# Altium schematic sheet COM-Radio-UHF.SchDoc: CDH Connector
size A2; CompanyName: Lockheed Martin; Organization: Colorado Space Grant; DocumentNumber: 4; SheetNumber: 6; SheetTotal: 7; ProjectName: COM_Digital.prjpcb
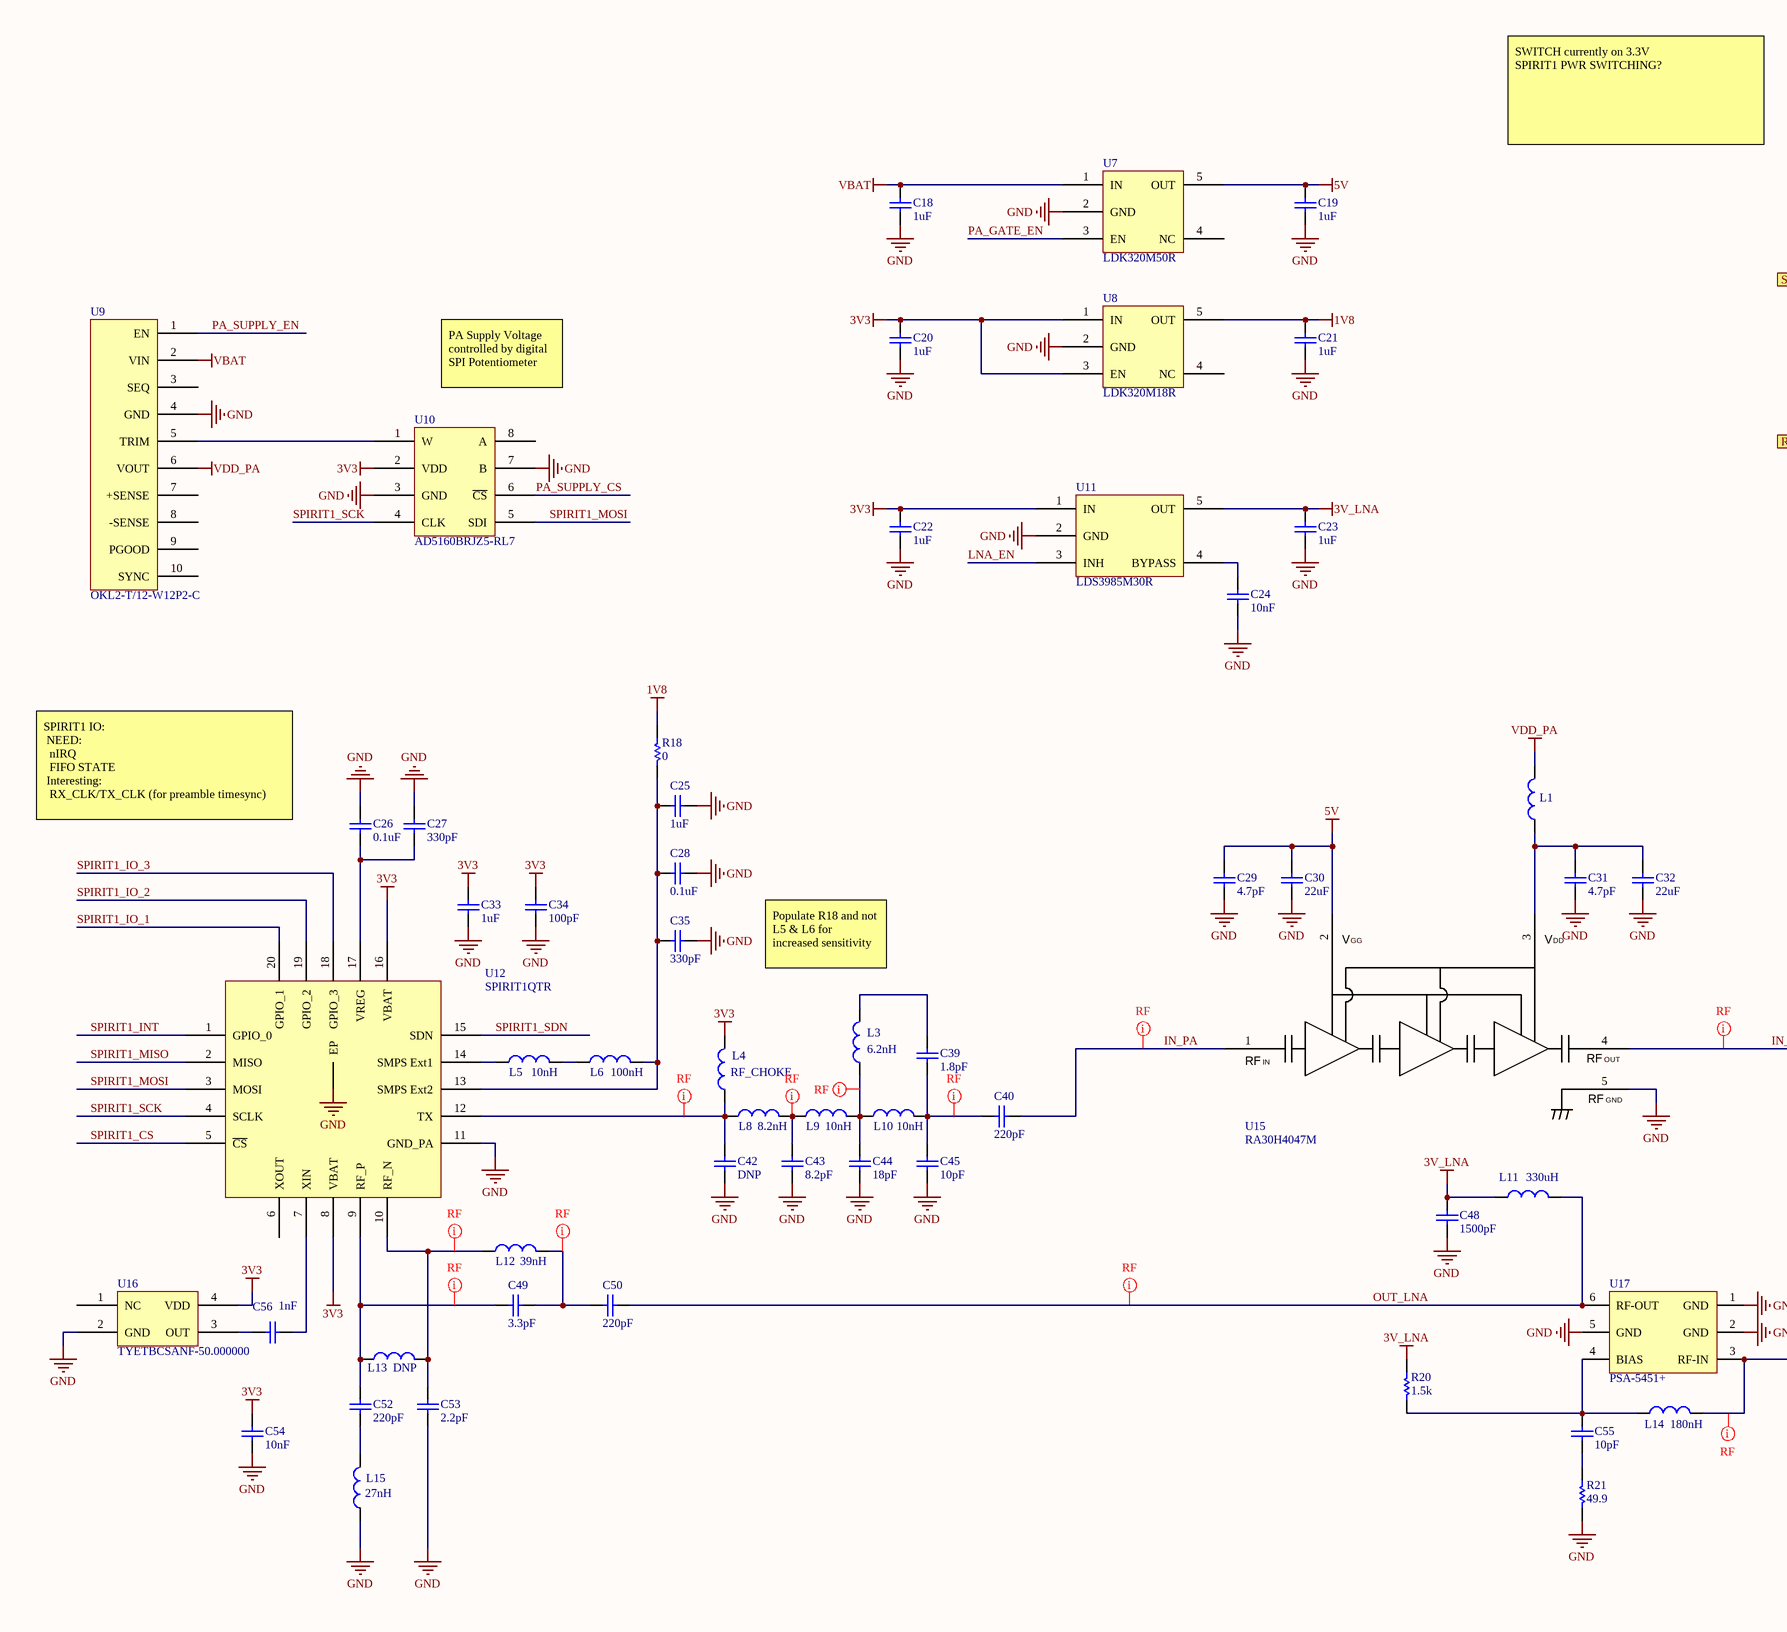
[diagram p0: COM-Radio-UHF.SchDoc, left]
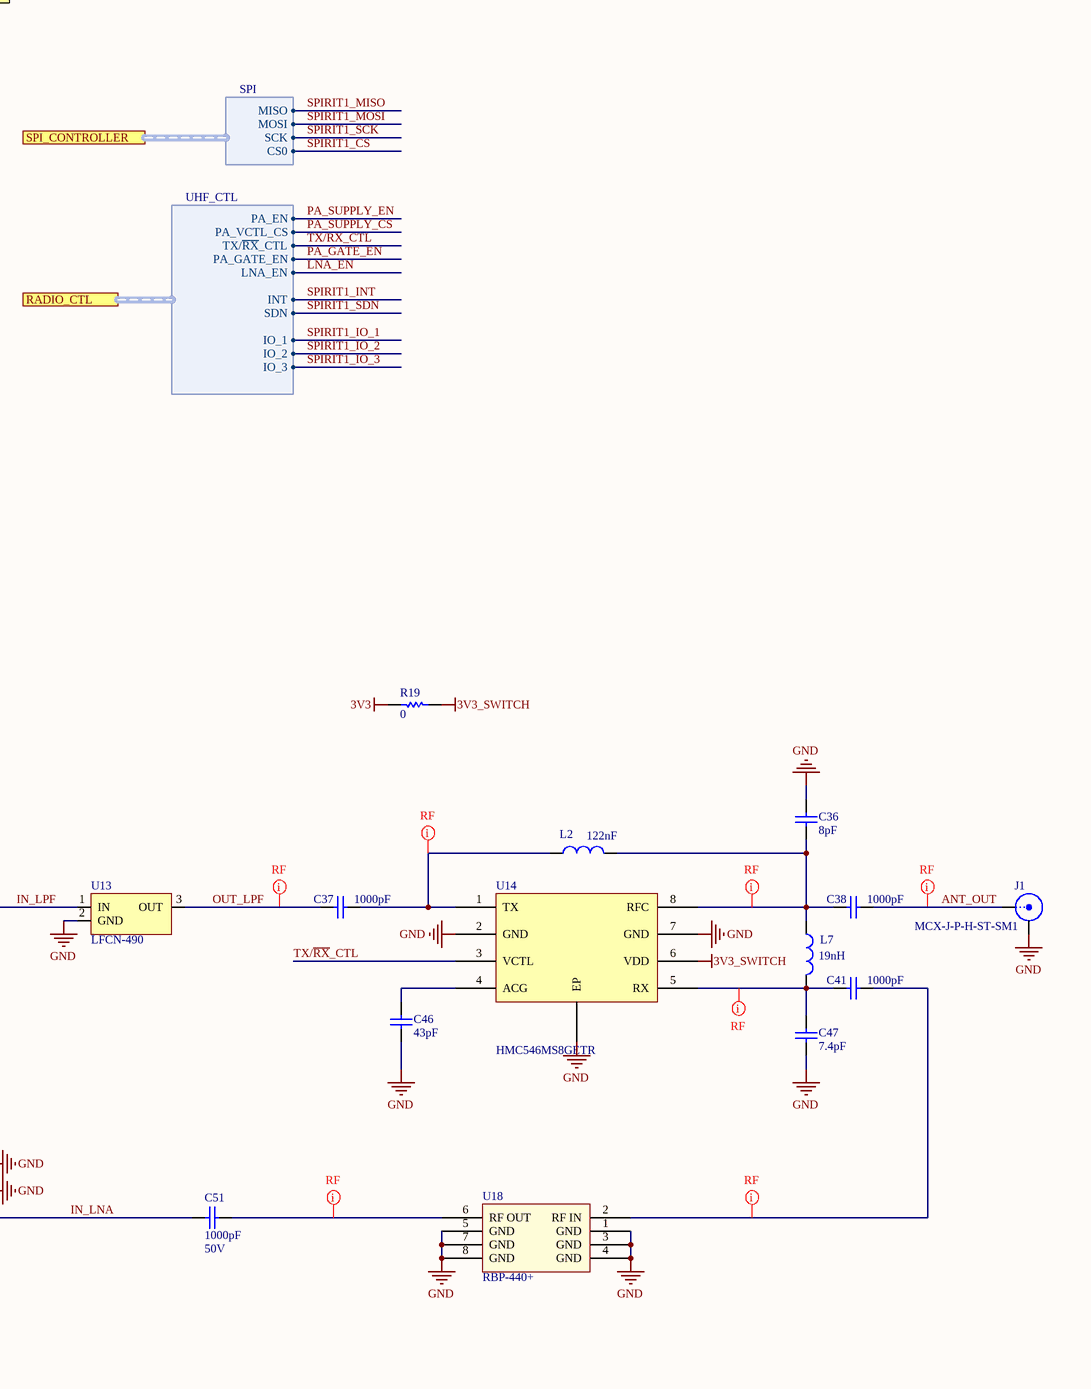
[diagram p1: COM-Radio-UHF.SchDoc, right]

## Parts
C18  Capacitance: 1uF  [1608[0603]]  (hidden comment: CL10B105MO8NNWC)
C19  Capacitance: 1uF  [1608[0603]]  (hidden comment: CL10B105MO8NNWC)
C20  Capacitance: 1uF  [1608[0603]]  (hidden comment: CL10B105MO8NNWC)
C21  Capacitance: 1uF  [1608[0603]]  (hidden comment: CL10B105MO8NNWC)
C22  Capacitance: 1uF  [1608[0603]]  (hidden comment: CL10B105MO8NNWC)
C23  Capacitance: 1uF  [1608[0603]]  (hidden comment: CL10B105MO8NNWC)
C24  Capacitance: 10nF  [1608[0603]]  (hidden comment: CL10B103KO8NNNC)
C25  Capacitance: 1uF  [1608[0603]]  (hidden comment: CL10B105MO8NNWC)
C26  Capacitance: 0.1uF  [1608[0603]]  (hidden comment: CL10B104KB8ZW6C)
C27  Capacitance: 330pF  [1608[0603]]  (hidden comment: CL10C331JB8NFNC)
C28  Capacitance: 0.1uF  [1608[0603]]  (hidden comment: CL10B104KB8ZW6C)
C29  Capacitance: 4.7pF  [1608[0603]]  (hidden comment: CL10C4R7BB8NNNC)
C30  Capacitance: 22uF  [C1210_M]  (hidden comment: C3225X5R1C226M250AA)
C31  Capacitance: 4.7pF  [1608[0603]]  (hidden comment: CL10C4R7BB8NNNC)
C32  Capacitance: 22uF  [C1210_M]  (hidden comment: C3225X5R1C226M250AA)
C33  Capacitance: 1uF  [1608[0603]]  (hidden comment: CL10B105MO8NNWC)
C34  Capacitance: 100pF  [1608[0603]]  (hidden comment: C0603C101K5GACTU)
C35  Capacitance: 330pF  [1608[0603]]  (hidden comment: CL10B331JB8NNNC)
C36  Capacitance: 8pF  [1608[0603]]  (hidden comment: CL10C080CB8NNNC)
C37  Capacitance: 1000pF  [1608[0603]]  (hidden comment: C0603X102J5GAC7867)
C38  Capacitance: 1000pF  [1608[0603]]  (hidden comment: C0603X102J5GAC7867)
C39  Capacitance: 1.8pF  [1608[0603]]  (hidden comment: CL10C1R8BB8NNNC)
C40  Capacitance: 220pF  [1608[0603]]  (hidden comment: CL10C221JB8NNNC)
C41  Capacitance: 1000pF  [1608[0603]]  (hidden comment: C0603X102J5GAC7867)
C42  Capacitance: DNP  [1608[0603]]  (hidden comment: Cap)
C43  Capacitance: 8.2pF  [1608[0603]]  (hidden comment: CL10C8R2DB8NNNC)
C44  Capacitance: 18pF  [1608[0603]]  (hidden comment: C0603C180K5GACTU)
C45  Capacitance: 10pF  [1608[0603]]  (hidden comment: CL10C100JB8NCNC)
C46  Capacitance: 43pF  [1608[0603]]  (hidden comment: C0603C430J5GACTU)
C47  Capacitance: 7.4pF  [1608[0603]]  (hidden comment: CBR06C749B5GAC)
C48  Capacitance: 1500pF  [1608[0603]]  (hidden comment: C0603C152J5GACTU)
C49  Capacitance: 3.3pF  [1608[0603]]  (hidden comment: 06035A3R3BAT2A)
C50  Capacitance: 220pF  [1608[0603]]  (hidden comment: CL10C221JB8NNNC)
C51  Capacitance: 1000pF  Voltage: 50V  [1608[0603]]  (hidden comment: C0603X102J5GAC7867)
C52  Capacitance: 220pF  [1608[0603]]  (hidden comment: CL10C221JB8NNNC)
C53  Capacitance: 2.2pF  [1608[0603]]  (hidden comment: C0603C229B5GAC7867)
C54  Capacitance: 10nF  [1608[0603]]  (hidden comment: Cap)
C55  Capacitance: 10pF  [1608[0603]]  (hidden comment: CL10C100JB8NCNC)
C56  Capacitance: 1nF  [1608[0603]]  (hidden comment: CL10B102KA8NNNC)
J1  MCX-J-P-H-ST-SM1  [MCX-J-P-H-ST-SM1]
L1  SDR2207-4R7ML  [SDR2207-4R7ML]  (value not drawn)
L2  Inductance: 122nF  [1608[0603]]  (hidden comment: PE-0603CD121GTT)
L3  Inductance: 6.2nH  [1608[0603]]  (hidden comment: LQG18HH6N2S00D)
L4  Type: RF_CHOKE  [6-0805_M]  (hidden comment: LQM21FN100M80L)
L5  Inductance: 10nH  [1608[0603]]  (hidden comment: L-14C10NJV4T)
L6  Inductance: 100nH  [1608[0603]]  (hidden comment: HK1608R10J-T)
L7  Inductance: 19nH  [1608[0603]]  (hidden comment: LQW18AN19NJ8ZD)
L8  Inductance: 8.2nH  [1608[0603]]  (hidden comment: L-14C8N2JV4T)
L9  Inductance: 10nH  [1608[0603]]  (hidden comment: L-14C10NJV4T)
L10  Inductance: 10nH  [1608[0603]]  (hidden comment: L-14C10NJV4T)
L11  Inductance: 330uH  [1608[0603]]  (hidden comment: SRR7045-331M)
L12  Inductance: 39nH  [1608[0603]]  (hidden comment: L-14C39NJV4T)
L13  DNP  [1608[0603]]
L14  Inductance: 180nH  [1608[0603]]  (hidden comment: CIH10TR18JNC)
L15  Inductance: 27nH  [1608[0603]]  (hidden comment: L-14C27NJV4T)
R18  Resistance: 0  [1608[0603]]  (hidden comment: CRCW06030000Z0EAC)
R19  Resistance: 0  [1608[0603]]  (hidden comment: CRCW06030000Z0EAC)
R20  Resistance: 1.5k  [1608[0603]]  (hidden comment: CRG0603F1K5)
R21  Resistance: 49.9  [1608[0603]]  (hidden comment: ERJ-3EKF49R9V)
U7  LDK320M50R  [SOT95P280X145-5N]
U8  LDK320M18R  [SOT95P280X145-5N]
U9  OKL2-T/12-W12P2-C  [OKL2-T/12-W12P2-C]
U10  AD5160BRJZ5-RL7  [TSOP65P280X130-8N]
U11  LDS3985M30R  [SOT95P280X145-5N]
U12  SPIRIT1QTR  [QFN50P400X400X100_HS-21N]
U13  LFCN-490  [LFCN-490]
U14  HMC546MS8GETR  [TSOP65P490X110_HS-9N]
U15  RA30H4047M  [RA30H4047M_BRD_MNT]
U16  TYETBCSANF-50.000000  [TYETBCSANF]
U17  PSA-5451+  [SOT65P215X100-6N]
U18  RBP-440+  [RBP-440+]

## Ports
RADIO_CTL (harness UHF_CTL), SPI_CONTROLLER (harness SPI)

## Harnesses
SPI: MISO, MOSI, SCK, CS0
UHF_CTL: PA_EN, PA_VCTL_CS, TX/~{RX}_CTL, INT, SDN, IO_1, IO_2, IO_3, PA_GATE_EN, LNA_EN

## Nets
1V8: C21.2 R18.1 U8.5(OUT)
3V3: C20.2 C22.2 C33.2 C34.2 C54.2 L4.1 R19.2 U8.1(IN) U8.3(EN) U10.2(VDD) U11.1(IN) U12.8(VBAT) U12.16(VBAT) U16.4(VDD)
3V3_SWITCH: R19.1 U14.6(VDD)
3V_LNA: C23.2 C48.2 L11.2 R20.2 U11.5(OUT)
5V: C19.2 C29.2 C30.2 U7.5(OUT) U15.2(VGG)
GND: C18.1 C19.1 C20.1 C21.1 C22.1 C23.1 C24.1 C25.1 C26.2 C27.2 C28.1 C29.1 C30.1 C31.1 C32.1 C33.1 C34.1 C35.2 C36.2 C42.1 C43.1 C44.1 C45.1 C46.1 C47.1 C48.1 C53.1 C54.1 J1.2 L15.2 R21.2 U7.2(GND) U8.2(GND) U9.4(GND) U10.3(GND) U10.7(B) U11.2(GND) U12.11(GND_PA) U12.21(EP) U13.2(GND) U14.2(GND) U14.7(GND) U14.9(EP) U15.5(POUT) U16.2(GND) U17.1(GND) U17.2(GND) U17.5(GND) U18.1(GND) U18.3(GND) U18.4(GND) U18.5(GND) U18.7(GND) U18.8(GND)
VBAT: C18.2 U7.1(IN) U9.2(VIN)
VDD_PA: L1.1 U9.6(VOUT)
ANT_OUT: C38.2 J1.1
IN_LNA: C51.2 L14.1 U17.3(RF-IN)
IN_LPF: U13.1(IN) U15.4(POUT)
IN_PA: C40.1 U15.1(PIN)
LNA_EN: U11.3(INH) ; port RADIO_CTL.LNA_EN
OUT_LNA: C50.1 L11.1 U17.6(RF-OUT)
OUT_LPF: C37.1 U13.3(OUT)
PA_GATE_EN: U7.3(EN) ; port RADIO_CTL.PA_GATE_EN
PA_SUPPLY_CS: U10.6(~{CS}) ; port RADIO_CTL.PA_VCTL_CS
PA_SUPPLY_EN: U9.1(EN) ; port RADIO_CTL.PA_EN
SPIRIT1_CS: U12.5(~{CS}) ; port SPI_CONTROLLER.CS0
SPIRIT1_INT: U12.1(GPIO_0) ; port RADIO_CTL.INT
SPIRIT1_IO_1: U12.20(GPIO_1) ; port RADIO_CTL.IO_1
SPIRIT1_IO_2: U12.19(GPIO_2) ; port RADIO_CTL.IO_2
SPIRIT1_IO_3: U12.18(GPIO_3) ; port RADIO_CTL.IO_3
SPIRIT1_MISO: U12.2(MISO) ; port SPI_CONTROLLER.MISO
SPIRIT1_MOSI: U10.5(SDI) U12.3(MOSI) ; port SPI_CONTROLLER.MOSI
SPIRIT1_SCK: U10.4(CLK) U12.4(SCLK) ; port SPI_CONTROLLER.SCK
SPIRIT1_SDN: U12.15(SDN) ; port RADIO_CTL.SDN
TX/~{RX}_CTL: U14.3(VCTL) ; port RADIO_CTL.TX/~{RX}_CTL
NetC24_2: C24.2 U11.4(BYPASS)
NetC25_2: C25.2 C28.2 C35.1 L6.1 R18.2 U12.13(SMPS_Ext2)
NetC26_1: C26.1 C27.1 U12.17(VREG)
NetC31_2: C31.2 C32.2 L1.2 U15.3(VDD)
NetC36_1: C36.1 C38.1 L2.1 L7.2 U14.8(RFC)
NetC37_2: C37.2 L2.2 U14.1(TX)
NetC39_1: C39.1 C40.2 C45.2 L10.1
NetC39_2: C39.2 L3.1
NetC41_1: C41.1 C47.2 L7.1 U14.5(RX)
NetC41_2: C41.2 U18.2(RF_IN)
NetC42_2: C42.2 L4.2 L8.2 U12.12(TX)
NetC43_2: C43.2 L8.1 L9.2
NetC44_2: C44.2 L3.2 L9.1 L10.2
NetC46_2: C46.2 U14.4(ACG)
NetC49_1: C49.1 C50.2 L12.1
NetC49_2: C49.2 C52.2 L13.2 U12.9(RF_P)
NetC51_1: C51.1 U18.6(RF_OUT)
NetC52_1: C52.1 L15.1
NetC53_2: C53.2 L12.2 L13.1 U12.10(RF_N)
NetC55_1: C55.1 R21.1
NetC55_2: C55.2 L14.2 R20.1 U17.4(BIAS)
NetC56_1: C56.1 U12.7(XIN)
NetC56_2: C56.2 U16.3(OUT)
NetL5_1: L5.1 L6.2
NetL5_2: L5.2 U12.14(SMPS_Ext1)
NetU9_5: U9.5(TRIM) U10.1(W)

Not connected (* = marked no-connect by the designer): U7 4(NC); U8 4(NC); U9 3(SEQ) 7(+SENSE) 8(-SENSE) 9(PGOOD) 10(SYNC); U10 8(A); U12 6(XOUT); U16 1(NC)

## Layout directives
net class RF: ANT_OUT, IN_LNA, IN_LPF, IN_PA, NetC36_1, NetC37_2, NetC39_1, NetC41_1, NetC41_2, NetC42_2, NetC43_2, NetC44_2, NetC49_1, NetC49_2, NetC51_1, NetC53_2, OUT_LNA, OUT_LPF

## Notes on the sheet
- SWITCH currently on 3.3V
  SPIRIT1 PWR SWITCHING?
- PA Supply Voltage controlled by digital SPI Potentiometer
- SPIRIT1 IO:
  NEED:
  nIRQ
  FIFO STATE
  Interesting:
  RX_CLK/TX_CLK (for preamble timesync)
- Populate R18 and not L5 & L6 for increased sensitivity
- Title
- Size:
- Date:
- File:
- A2
- Number:
- Time:
- Revision:
- Sheet
- of
- (in symbol RA30H4047M) V; GG; DD; OUT; RF; IN; GND

## Library data of the parts
C18-C23 = 4997: CAP CER 1UF 16V X7R 0603; PartNumber: CGA2B2X7R1H102M050BA; Manufacturer: TDK; ID: 4997; Tolerance: ±20%; Category: Ceramic; Status: Unchecked; Package: 0402 (1005 Metric); ComponentLink1Description: Datasheet; ComponentLink1URL: http://product.tdk.com/capacitor/mlcc/en/documents/mlcc_automotive_general_en.pdf
C24 = 4997: CAP CER 10000PF 16V X7R 0603; PartNumber: CGA2B2X7R1H102M050BA; Manufacturer: TDK; ID: 4997; Tolerance: ±20%; Category: Ceramic; Status: Unchecked; Package: 0402 (1005 Metric); ComponentLink1Description: Datasheet; ComponentLink1URL: http://product.tdk.com/capacitor/mlcc/en/documents/mlcc_automotive_general_en.pdf
C25 C33 = 27258: CAP CER 1UF 16V X7R 0603; PartNumber: CBR04C100J5GAC; Manufacturer: Kemet; ID: 27258; Tolerance: 5%; Category: Ceramic; Status: Unchecked; Package: 0402 (1005 Metric); ComponentLink1Description: Datasheet; ComponentLink1URL: http://www.mouser.com/catalog/catalogusd/646/990.pdf
C26 C28 = 27258: MLCC 1608(0603) X7R 100NF 10% 50; PartNumber: CBR04C100J5GAC; Manufacturer: Kemet; ID: 27258; Tolerance: 5%; Category: Ceramic; Status: Unchecked; Package: 0402 (1005 Metric); ComponentLink1Description: Datasheet; ComponentLink1URL: http://www.mouser.com/catalog/catalogusd/646/990.pdf
C27 = 27258: CAP CER 330PF 50V C0G/NP0 0603; PartNumber: CBR04C100J5GAC; Manufacturer: Kemet; ID: 27258; Tolerance: 5%; Category: Ceramic; Status: Unchecked; Package: 0402 (1005 Metric); ComponentLink1Description: Datasheet; ComponentLink1URL: http://www.mouser.com/catalog/catalogusd/646/990.pdf
C29 C31 = 4997: CAP CER 4.7PF 50V C0G/NP0 0603; PartNumber: CGA2B2X7R1H102M050BA; Manufacturer: TDK; ID: 4997; Tolerance: ±20%; Category: Ceramic; Status: Unchecked; Package: 0402 (1005 Metric); ComponentLink1Description: Datasheet; ComponentLink1URL: http://product.tdk.com/capacitor/mlcc/en/documents/mlcc_automotive_general_en.pdf
C30 C32 = 4997: CAP CER 22UF 16V X5R 1210; PartNumber: CGA2B2X7R1H102M050BA; Manufacturer: TDK; ID: 4997; Tolerance: ±20%; Category: Ceramic; Status: Unchecked; Package: 0402 (1005 Metric); ComponentLink1Description: Datasheet; ComponentLink1URL: http://product.tdk.com/capacitor/mlcc/en/documents/mlcc_automotive_general_en.pdf
C34 = 27258: CAP CER 100PF 50V C0G/NP0 0603; PartNumber: CBR04C100J5GAC; Manufacturer: Kemet; ID: 27258; Tolerance: 5%; Category: Ceramic; Status: Unchecked; Package: 0402 (1005 Metric); ComponentLink1Description: Datasheet; ComponentLink1URL: http://www.mouser.com/catalog/catalogusd/646/990.pdf
C35 = 27258: CAP CER 330PF 50V X7R 0603; PartNumber: CBR04C100J5GAC; Manufacturer: Kemet; ID: 27258; Tolerance: 5%; Category: Ceramic; Status: Unchecked; Package: 0402 (1005 Metric); ComponentLink1Description: Datasheet; ComponentLink1URL: http://www.mouser.com/catalog/catalogusd/646/990.pdf
C36 = 4997: CAP CER 8PF 50V C0G/NP0 0603; PartNumber: CGA2B2X7R1H102M050BA; Manufacturer: TDK; ID: 4997; Tolerance: ±20%; Category: Ceramic; Status: Unchecked; Package: 0402 (1005 Metric); ComponentLink1Description: Datasheet; ComponentLink1URL: http://product.tdk.com/capacitor/mlcc/en/documents/mlcc_automotive_general_en.pdf
C37 C38 C41 C51 = 4997: CAP CER 1000PF 50V C0G/NP0 0603; PartNumber: CGA2B2X7R1H102M050BA; Manufacturer: TDK; ID: 4997; Tolerance: ±20%; Category: Ceramic; Status: Unchecked; Package: 0402 (1005 Metric); ComponentLink1Description: Datasheet; ComponentLink1URL: http://product.tdk.com/capacitor/mlcc/en/documents/mlcc_automotive_general_en.pdf
C39 = 27258: CAP CER 1.8PF 50V C0G/NP0 0603; PartNumber: CBR04C100J5GAC; Manufacturer: Kemet; ID: 27258; Tolerance: 5%; Category: Ceramic; Status: Unchecked; Package: 0402 (1005 Metric); ComponentLink1Description: Datasheet; ComponentLink1URL: http://www.mouser.com/catalog/catalogusd/646/990.pdf
C40 C50 C52 = 27258: CAP CER 220PF 50V C0G/NP0 0603; PartNumber: CBR04C100J5GAC; Manufacturer: Kemet; ID: 27258; Tolerance: 5%; Category: Ceramic; Status: Unchecked; Package: 0402 (1005 Metric); ComponentLink1Description: Datasheet; ComponentLink1URL: http://www.mouser.com/catalog/catalogusd/646/990.pdf
C42 C54 = 27258: RF Microwave MLCCs; PartNumber: CBR04C100J5GAC; Manufacturer: Kemet; ID: 27258; Tolerance: 5%; Category: Ceramic; Status: Unchecked; Package: 0402 (1005 Metric); ComponentLink1Description: Datasheet; ComponentLink1URL: http://www.mouser.com/catalog/catalogusd/646/990.pdf
C43 = 27258: CAP CER 8.2PF 50V C0G/NP0 0603; PartNumber: CBR04C100J5GAC; Manufacturer: Kemet; ID: 27258; Tolerance: 5%; Category: Ceramic; Status: Unchecked; Package: 0402 (1005 Metric); ComponentLink1Description: Datasheet; ComponentLink1URL: http://www.mouser.com/catalog/catalogusd/646/990.pdf
C44 = 27258: CAP CER 18PF 50V C0G/NP0 0603; PartNumber: CBR04C100J5GAC; Manufacturer: Kemet; ID: 27258; Tolerance: 5%; Category: Ceramic; Status: Unchecked; Package: 0402 (1005 Metric); ComponentLink1Description: Datasheet; ComponentLink1URL: http://www.mouser.com/catalog/catalogusd/646/990.pdf
C45 C55 = 27258: CAP CER 10PF 50V C0G/NP0 0603; PartNumber: CBR04C100J5GAC; Manufacturer: Kemet; ID: 27258; Tolerance: 5%; Category: Ceramic; Status: Unchecked; Package: 0402 (1005 Metric); ComponentLink1Description: Datasheet; ComponentLink1URL: http://www.mouser.com/catalog/catalogusd/646/990.pdf
C46 = 4997: CAP CER 43PF 50V C0G/NP0 0603; PartNumber: CGA2B2X7R1H102M050BA; Manufacturer: TDK; ID: 4997; Tolerance: ±20%; Category: Ceramic; Status: Unchecked; Package: 0402 (1005 Metric); ComponentLink1Description: Datasheet; ComponentLink1URL: http://product.tdk.com/capacitor/mlcc/en/documents/mlcc_automotive_general_en.pdf
C47 = 4997: CAP CER RF 7.4PF 50V +/-0.1 PF C; PartNumber: CGA2B2X7R1H102M050BA; Manufacturer: TDK; ID: 4997; Tolerance: ±20%; Category: Ceramic; Status: Unchecked; Package: 0402 (1005 Metric); ComponentLink1Description: Datasheet; ComponentLink1URL: http://product.tdk.com/capacitor/mlcc/en/documents/mlcc_automotive_general_en.pdf
C48 = 4997: CAP CER 1500PF 50V C0G/NP0 0603; PartNumber: CGA2B2X7R1H102M050BA; Manufacturer: TDK; ID: 4997; Tolerance: ±20%; Category: Ceramic; Status: Unchecked; Package: 0402 (1005 Metric); ComponentLink1Description: Datasheet; ComponentLink1URL: http://product.tdk.com/capacitor/mlcc/en/documents/mlcc_automotive_general_en.pdf
C49 = 27258: CAP CER 3.3PF 50V C0G/NP0 0603; PartNumber: CBR04C100J5GAC; Manufacturer: Kemet; ID: 27258; Tolerance: 5%; Category: Ceramic; Status: Unchecked; Package: 0402 (1005 Metric); ComponentLink1Description: Datasheet; ComponentLink1URL: http://www.mouser.com/catalog/catalogusd/646/990.pdf
C53 = 27258: CAP CER 2.2PF 50V NP0 0603; PartNumber: CBR04C100J5GAC; Manufacturer: Kemet; ID: 27258; Tolerance: 5%; Category: Ceramic; Status: Unchecked; Package: 0402 (1005 Metric); ComponentLink1Description: Datasheet; ComponentLink1URL: http://www.mouser.com/catalog/catalogusd/646/990.pdf
C56 = 27258: CAP CER 1000PF 25V X7R 0603; PartNumber: CBR04C100J5GAC; Manufacturer: Kemet; ID: 27258; Tolerance: 5%; Category: Ceramic; Status: Unchecked; Package: 0402 (1005 Metric); ComponentLink1Description: Datasheet; ComponentLink1URL: http://www.mouser.com/catalog/catalogusd/646/990.pdf
J1 = MMCX-J-P-H-RA-TH1: MCX Connector Jack, Female Socket 50 Ohm Surface Mount Solder; PartNumber: MMCX-J-P-H-RA-TH1
L1 = 25811: FIXED IND 4.7UH 8.5A 8.8 MOHM; PartNumber: MLG1005SR18JT000; Manufacturer: TDK; ID: 25811; DCR: 3.8 Ohm Max; Current: 150mA; Inductance: 4.7uH; Category: Chip Inductor; Status: Unchecked; Package: 0402 (1005 Metric); ComponentLink1Description: Datasheet; ComponentLink1URL: http://www.tdk.co.jp/tefe02/e521_mlg.pdf
L2 = 25811: FIXED IND 122NH 300MA 650 MOHM; PartNumber: MLG1005SR18JT000; Manufacturer: TDK; ID: 25811; DCR: 3.8 Ohm Max; Current: 150mA; Category: Chip Inductor; Status: Unchecked; Package: 0402 (1005 Metric); ComponentLink1Description: Datasheet; ComponentLink1URL: http://www.tdk.co.jp/tefe02/e521_mlg.pdf
L3 = 25811: FIXED IND 6.2NH 430MA 200 MOHM; PartNumber: MLG1005SR18JT000; Manufacturer: TDK; ID: 25811; DCR: 3.8 Ohm Max; Current: 150mA; Category: Chip Inductor; Status: Unchecked; Package: 0402 (1005 Metric); ComponentLink1Description: Datasheet; ComponentLink1URL: http://www.tdk.co.jp/tefe02/e521_mlg.pdf
L4 = 25811: FIXED IND 10UH 100MA 300 MOHM; PartNumber: MLG1005SR18JT000; Manufacturer: TDK; ID: 25811; DCR: 3.8 Ohm Max; Current: 150mA; Inductance: 10uH; Category: Chip Inductor; Status: Unchecked; Package: 0402 (1005 Metric); ComponentLink1Description: Datasheet; ComponentLink1URL: http://www.tdk.co.jp/tefe02/e521_mlg.pdf
L5 L9 L10 = 25811: FIXED IND 10NH 300MA 350 MOHM; PartNumber: MLG1005SR18JT000; Manufacturer: TDK; ID: 25811; DCR: 3.8 Ohm Max; Current: 150mA; Category: Chip Inductor; Status: Unchecked; Package: 0402 (1005 Metric); ComponentLink1Description: Datasheet; ComponentLink1URL: http://www.tdk.co.jp/tefe02/e521_mlg.pdf
L6 = 25811: FIXED IND 100NH 300MA 100 MOHM; PartNumber: MLG1005SR18JT000; Manufacturer: TDK; ID: 25811; DCR: 3.8 Ohm Max; Current: 150mA; Category: Chip Inductor; Status: Unchecked; Package: 0402 (1005 Metric); ComponentLink1Description: Datasheet; ComponentLink1URL: http://www.tdk.co.jp/tefe02/e521_mlg.pdf
L7 = 25811: FIXED IND 19NH 1.4A 75 MOHM; PartNumber: MLG1005SR18JT000; Manufacturer: TDK; ID: 25811; DCR: 3.8 Ohm Max; Current: 150mA; Category: Chip Inductor; Status: Unchecked; Package: 0402 (1005 Metric); ComponentLink1Description: Datasheet; ComponentLink1URL: http://www.tdk.co.jp/tefe02/e521_mlg.pdf
L8 = 25811: FIXED IND 8.2NH 300MA 330 MOHM; PartNumber: MLG1005SR18JT000; Manufacturer: TDK; ID: 25811; DCR: 3.8 Ohm Max; Current: 150mA; Category: Chip Inductor; Status: Unchecked; Package: 0402 (1005 Metric); ComponentLink1Description: Datasheet; ComponentLink1URL: http://www.tdk.co.jp/tefe02/e521_mlg.pdf
L11 = 25811: FIXED IND 330UH 400MA 730 MOHM; PartNumber: MLG1005SR18JT000; Manufacturer: TDK; ID: 25811; DCR: 3.8 Ohm Max; Current: 150mA; Category: Chip Inductor; Status: Unchecked; Package: 0402 (1005 Metric); ComponentLink1Description: Datasheet; ComponentLink1URL: http://www.tdk.co.jp/tefe02/e521_mlg.pdf
L12 = 25811: FIXED IND 39NH 300MA 700 MOHM; PartNumber: MLG1005SR18JT000; Manufacturer: TDK; ID: 25811; DCR: 3.8 Ohm Max; Current: 150mA; Category: Chip Inductor; Status: Unchecked; Package: 0402 (1005 Metric); ComponentLink1Description: Datasheet; ComponentLink1URL: http://www.tdk.co.jp/tefe02/e521_mlg.pdf
L13 = 25811: PartNumber: MLG1005SR18JT000; Manufacturer: TDK; Inductance: 180nH; ID: 25811; DCR: 3.8 Ohm Max; Current: 150mA; Category: Chip Inductor; Status: Unchecked; Package: 0402 (1005 Metric); ComponentLink1Description: Datasheet; ComponentLink1URL: http://www.tdk.co.jp/tefe02/e521_mlg.pdf
L14 = 25811: FIXED IND 180NH 250MA 1.3 OHM; PartNumber: MLG1005SR18JT000; Manufacturer: TDK; ID: 25811; DCR: 3.8 Ohm Max; Current: 150mA; Category: Chip Inductor; Status: Unchecked; Package: 0402 (1005 Metric); ComponentLink1Description: Datasheet; ComponentLink1URL: http://www.tdk.co.jp/tefe02/e521_mlg.pdf
L15 = 25811: FIXED IND 27NH 300MA 600 MOHM; PartNumber: MLG1005SR18JT000; Manufacturer: TDK; ID: 25811; DCR: 3.8 Ohm Max; Current: 150mA; Category: Chip Inductor; Status: Unchecked; Package: 0402 (1005 Metric); ComponentLink1Description: Datasheet; ComponentLink1URL: http://www.tdk.co.jp/tefe02/e521_mlg.pdf
R18 = 4641: RES SMD 0 OHM JUMP 1/10W 0603; PartNumber: CRCW040249R9FKED; Manufacturer: Vishay; ID: 4641; Power: 0.063W, 1/16W; Tolerance: ±1%; Category: General Purpose; Status: Unchecked; Package: 0402 (1005 Metric); ComponentLink1Description: Datasheet; ComponentLink1URL: http://www.vishay.com/doc?20035
R19 = 3863: RES SMD 0 OHM JUMP 1/10W 0603; PartNumber: CRCW04021K50FKED; Manufacturer: Vishay; ID: 3863; Power: 0.063W, 1/16W; Tolerance: ±1%; Category: General Purpose; Status: Unchecked; Package: 0402 (1005 Metric); ComponentLink1Description: Datasheet; ComponentLink1URL: http://www.vishay.com/doc?20035
R20 = 3863: RES SMD 1.5K OHM 1% 1/10W 0603; PartNumber: CRCW04021K50FKED; Manufacturer: Vishay; ID: 3863; Power: 0.063W, 1/16W; Category: General Purpose; Status: Unchecked; Tolerance: ±1%; Package: 0402 (1005 Metric); ComponentLink1Description: Datasheet; ComponentLink1URL: http://www.vishay.com/doc?20035
R21 = 4641: RES SMD 49.9 OHM 1% 1/10W 0603; PartNumber: CRCW040249R9FKED; Manufacturer: Vishay; ID: 4641; Power: 0.063W, 1/16W; Category: General Purpose; Status: Unchecked; Tolerance: ±1%; Package: 0402 (1005 Metric); ComponentLink1Description: Datasheet; ComponentLink1URL: http://www.vishay.com/doc?20035
U7 = LDK320M50R: Linear Voltage Regulator IC Positive Fixed 1 Output 5V 200mA SOT-23-5
U8 = LDK320M18R: Linear Voltage Regulator IC Positive Fixed 1 Output 1.8V 200mA SOT-23-5
U9 = OKL2-T/12-W12P2-C: Non-Isolated PoL Module DC DC Converter 1 Output 0.69 ~ 5.5 V 12A 4.5V - 14V Input
U10 = AD5160BRJZ5-RL7: Digital Potentiometer 5k Ohm 1 Circuit 256 Taps SPI Interface SOT-23-8
U11 = LDS3985M30R: Linear Voltage Regulator IC Positive Fixed 1 Output 3V 300mA SOT-23-5
U12 = SPIRIT1QTR: IC RF TxRx Only General ISM < 1GHz 150MHz ~ 174MHz, 300MHz ~ 348MHz, 387MHz ~ 470MHz, 779MHz ~ 956MHz 20-VFQFN Exposed Pad
U13 = 28619: Low Pass Filter with knee at 490MHz; Manufacturer: Mini Circuits; ID: 28619; Param1: Band Pass; Param2: Surface Mount; Param3: 0-6.2GHz; PartNumber: LFCN-490; Category: Filters; Status: Unchecked; ComponentLink1Description: Datasheet; ComponentLink1URL: http://www.minicircuits.com/pdfs/LFCN-490.pdf
U14 = HMC546MS8GETR: RF Switch IC Cellular SPDT 2.2GHz 50 Ohm 8-MSOP
U15 = RA30H4047M: The RA30H4047M is a 30-watt RF MOSFET Amplifier / Module for 12.5-volt mobile radios that operate in the 400- to / 470-MHz range.
U16 = TYETBCSANF-50.000000: 50MHz TCXO Clipped Sine Wave Oscillator 2.8 V ~ 3.3 V 4-SMD, No Lead
U17 = 27278: LNA, DC-4GHz, 29dBm IP3; Manufacturer: Mini Circuits; ID: 27278; Param1: 1; PartNumber: PSA-5451+; Category: Amplifiers; Status: Unchecked; ComponentLink1Description: Datasheet; ComponentLink1URL: http://www.minicircuits.com/pdfs/PSA-5451+.pdf
U18 = 27277: RF Filter,0.5W; Manufacturer: Mini Circuits; ID: 27277; Param1: BPF; Param2: SMT; Param3: 440Mhz; Param4: 50 Ohms; PartNumber: RBP-440+; Category: Filters; Status: Unchecked; ComponentLink1Description: Datasheet; ComponentLink1URL: http://www.minicircuits.com/pdfs/RBP-440+.pdf